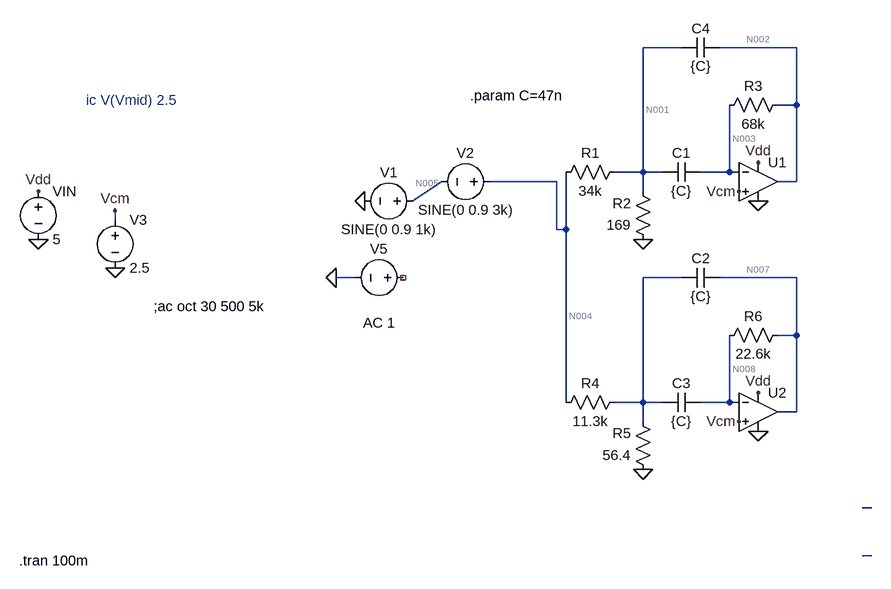
[diagram p0: schematic Bandpass Filter.asc]
Bandpass Filter.asc, the LTspice schematic file:
Version 4
SHEET 1 3780 2260
WIRE 288 -256 224 -256
WIRE 480 -256 352 -256
WIRE 480 -160 480 -256
WIRE 480 -160 448 -160
WIRE 224 -48 224 -256
WIRE 224 -48 176 -48
WIRE 256 -48 224 -48
WIRE 368 -48 368 -160
WIRE 368 -48 320 -48
WIRE 384 -48 368 -48
WIRE 80 -32 -32 -32
WIRE 480 -32 480 -160
WIRE 480 -32 448 -32
WIRE 224 -16 224 -48
WIRE -160 0 -112 -32
WIRE -736 32 -736 16
WIRE 80 48 80 -32
WIRE 96 48 96 -48
WIRE 96 48 80 48
WIRE -256 128 -288 128
WIRE 288 128 224 128
WIRE 480 128 352 128
WIRE 480 224 480 128
WIRE 480 224 448 224
WIRE 96 336 96 48
WIRE 224 336 224 128
WIRE 224 336 176 336
WIRE 256 336 224 336
WIRE 368 336 368 224
WIRE 368 336 320 336
WIRE 384 336 368 336
WIRE 480 352 480 224
WIRE 480 352 448 352
WIRE 224 368 224 336
WIRE 3696 512 3680 512
WIRE 3696 592 3680 592
FLAG -864 64 0
FLAG -736 16 Vcm
FLAG -736 112 0
FLAG 224 64 0
FLAG 416 0 0
FLAG 384 -16 Vcm
FLAG -864 -16 Vdd
FLAG 416 -64 Vdd
FLAG 224 448 0
FLAG 416 384 0
FLAG 384 368 Vcm
FLAG 416 320 Vdd
FLAG -288 128 0
FLAG -240 0 0
SYMBOL voltage -864 -32 R0
WINDOW 123 0 0 Left 0
WINDOW 39 0 0 Left 0
SYMATTR InstName VIN
SYMATTR Value 5
SYMBOL voltage -736 16 R0
WINDOW 123 0 0 Left 0
WINDOW 39 0 0 Left 0
SYMATTR InstName V3
SYMATTR Value 2.5
SYMBOL res 192 -64 R90
WINDOW 0 0 56 VBottom 2
WINDOW 3 32 56 VTop 2
SYMATTR InstName R1
SYMATTR Value 34k
SYMBOL res 240 80 R180
WINDOW 0 36 76 Left 2
WINDOW 3 36 40 Left 2
SYMATTR InstName R2
SYMATTR Value 169
SYMBOL res 352 -144 R270
WINDOW 0 32 56 VTop 2
WINDOW 3 0 56 VBottom 2
SYMATTR InstName R3
SYMATTR Value 68k
SYMBOL cap 352 -272 R90
WINDOW 0 0 32 VBottom 2
WINDOW 3 32 32 VTop 2
SYMATTR InstName C4
SYMATTR Value {C}
SYMBOL Opamps\\UniversalOpamp2 416 -32 R0
SYMATTR InstName U1
SYMBOL res 192 320 R90
WINDOW 0 0 56 VBottom 2
WINDOW 3 32 56 VTop 2
SYMATTR InstName R4
SYMATTR Value 11.3k
SYMBOL res 240 464 R180
WINDOW 0 36 76 Left 2
WINDOW 3 36 40 Left 2
SYMATTR InstName R5
SYMATTR Value 56.4
SYMBOL res 352 240 R270
WINDOW 0 32 56 VTop 2
WINDOW 3 0 56 VBottom 2
SYMATTR InstName R6
SYMATTR Value 22.6k
SYMBOL Opamps\\UniversalOpamp2 416 352 R0
SYMATTR InstName U2
SYMBOL voltage -160 128 R90
WINDOW 0 -32 56 VBottom 2
WINDOW 3 32 56 VTop 2
WINDOW 123 60 56 VTop 2
WINDOW 39 0 0 Left 0
SYMATTR InstName V5
SYMATTR Value ""
SYMATTR Value2 AC 1
SYMBOL cap 320 -64 R90
WINDOW 0 0 32 VBottom 2
WINDOW 3 32 32 VTop 2
SYMATTR InstName C1
SYMATTR Value {C}
SYMBOL cap 352 112 R90
WINDOW 0 0 32 VBottom 2
WINDOW 3 32 32 VTop 2
SYMATTR InstName C2
SYMATTR Value {C}
SYMBOL cap 320 320 R90
WINDOW 0 0 32 VBottom 2
WINDOW 3 32 32 VTop 2
SYMATTR InstName C3
SYMATTR Value {C}
SYMBOL voltage -144 0 R90
WINDOW 0 -32 56 VBottom 2
WINDOW 3 32 56 VTop 2
WINDOW 123 0 0 Left 0
WINDOW 39 0 0 Left 0
SYMATTR InstName V1
SYMATTR Value SINE(0 0.9 1k)
SYMBOL voltage -16 -32 R90
WINDOW 0 -32 56 VBottom 2
WINDOW 3 32 56 VTop 2
WINDOW 123 0 0 Left 0
WINDOW 39 0 0 Left 0
SYMATTR InstName V2
SYMATTR Value SINE(0 0.9 3k)
TEXT -672 176 Left 2 !;ac oct 30 500 5k
TEXT -784 -168 Left 2 ;ic V(Vmid) 2.5
TEXT -64 -176 Left 2 !.param C=47n
TEXT -896 600 Left 2 !.tran 100m

The netlist it stands for:
* Bandpass Filter.asc
VIN Vdd 0 5
V3 Vcm 0 2.5
R1 N001 N004 34k
R2 0 N001 169
R3 N003 N002 68k
C4 N002 N001 {C}
XU1 Vcm N003 Vdd 0 N002 level.2 Avol=1Meg GBW=10Meg Slew=10Meg ilimit=25m rail=0 Vos=0 phimargin=45 en=0 enk=0 in=0 ink=0 Rin=500Meg  ; pins IN+ IN- V+ V- OUT
R4 N006 N004 11.3k
R5 0 N006 56.4
R6 N008 N007 22.6k
XU2 Vcm N008 Vdd 0 N007 level.2 Avol=1Meg GBW=10Meg Slew=10Meg ilimit=25m rail=0 Vos=0 phimargin=45 en=0 enk=0 in=0 ink=0 Rin=500Meg  ; pins IN+ IN- V+ V- OUT
V5 NC_01 0 AC 1
C1 N003 N001 {C}
C2 N007 N006 {C}
C3 N008 N006 {C}
V1 N005 0 SINE(0 0.9 1k)
V2 N004 N005 SINE(0 0.9 3k)
;ac oct 30 500 5k
* ic V(Vmid) 2.5
.param C=47n
.tran 100m
.lib UniversalOpamps2.sub
.backanno
.end

* Results of the author's LTspice run, read from the files saved beside the schematic
* Operating Point, zero values left out:
*   V(vdd) = 5 V
*   V(vcm) = 2.5 V
*   V(n003) = 2.5 V
*   V(n002) = 2.5 V
*   V(n008) = 2.5 V
*   V(n007) = 2.5 V
*   I(Vin) = -500 µA
*   Ix(u1:3) = 250 µA
*   Ix(u1:4) = -250 µA
*   Ix(u1:5) = 198.3 pA
*   Ix(u2:3) = 250 µA
*   Ix(u2:4) = -250 µA
*   Ix(u2:5) = 198.3 pA
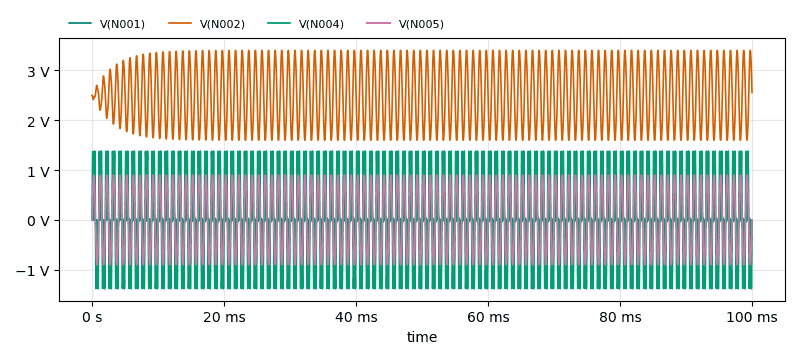
[diagram p1: Transient Analysis of Bandpass Filter.asc, plotted from the saved traces]
* Transient Analysis, 1 run:
*   V(N001): min -44.65 mV, max 44.23 mV, average 11.47 µV, rms 30.67 mV, last -44.65 mV
*   V(N002): min 1.599 V, max 3.401 V, average 2.501 V, rms 2.577 V, last 2.557 V
*   V(N004): min -1.382 V, max 1.382 V, average 438.4 nV, rms 897.2 mV, last 0 V
*   V(N005): min -899.7 mV, max 899.7 mV, average -797 nV, rms 633.6 mV, last 0 V